# EAGLE design SensorBoardR1 (EAGLE 7.6.0)
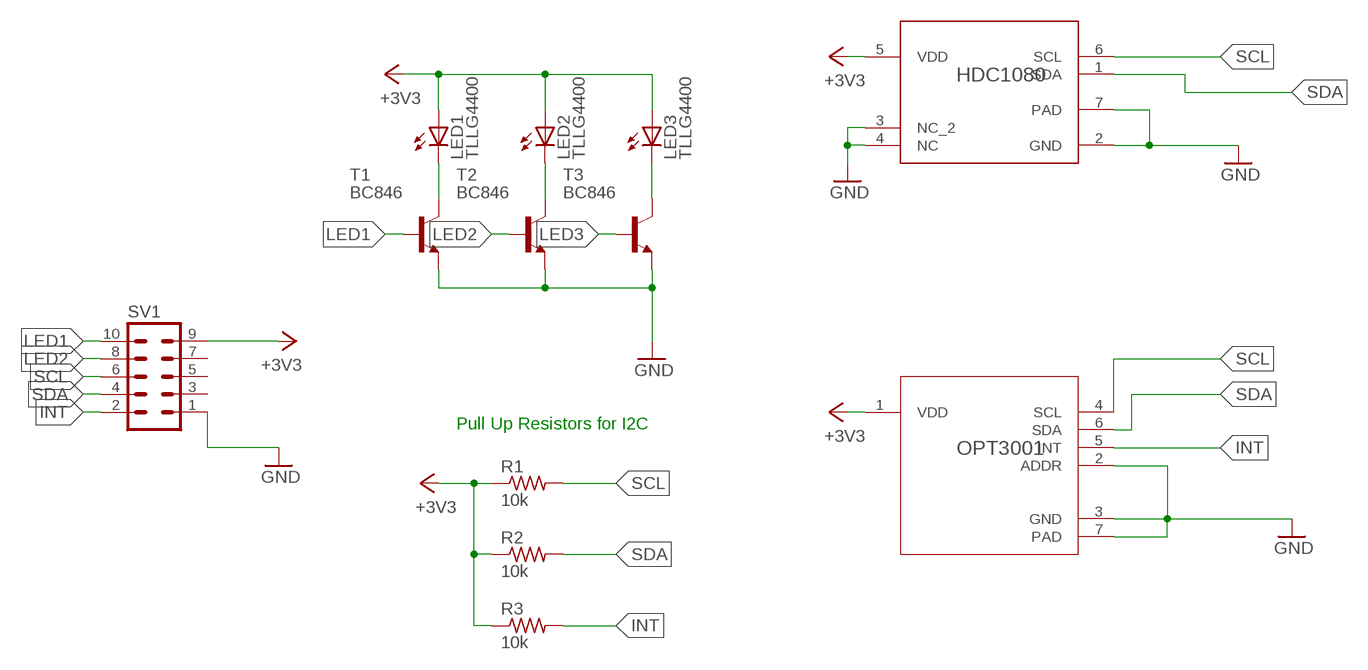
[diagram p0: schematic, sheet 1]

## Parts
HDC1080  HDC1080DMBR  [DMB0006A]
LED1  TLLG4400  [LED3MM]
LED2  TLLG4400  [LED3MM]
LED3  TLLG4400  [LED3MM]
OPT3001  OPT3001DNPR  [DNP0006A]
R1  10k  R-US_R0805  [R0805]
R2  10k  R-US_R0805  [R0805]
R3  10k  R-US_R0805  [R0805]
SV1  MA05-2  [MA05-2]
T1  BC846  [SOT23]
T2  BC846  [SOT23]
T3  BC846  [SOT23]

## Nets
+3V3: HDC1080.5(VDD) LED1.A LED2.A LED3.A OPT3001.1(VDD) R1.1 R2.1 R3.1 SV1.9
GND: HDC1080.2(GND) HDC1080.3(NC_2) HDC1080.4(NC) HDC1080.7(PAD) OPT3001.2(ADDR) OPT3001.3(GND) OPT3001.7(PAD) SV1.1 T1.2(E) T2.2(E) T3.2(E)
INT: OPT3001.5(INT) R3.2 SV1.2
LED1: SV1.10 T1.1(B)
LED2: SV1.8 T2.1(B)
LED3: T3.1(B)
N$2: LED3.K(C) T3.3(C)
N$3: LED2.K(C) T2.3(C)
N$4: LED1.K(C) T1.3(C)
SCL: HDC1080.6(SCL) OPT3001.4(SCL) R1.2 SV1.6
SDA: HDC1080.1(SDA) OPT3001.6(SDA) R2.2 SV1.4
Unconnected: SV1.3 SV1.5 SV1.7

## Notes on the sheet
- Pull Up Resistors for I2C

## Library data of the parts
HDC1080 = HDC1080:HDC1080DMBR; ALTERNATEPARTNUMBER: HDC1080DMBT; APPLICATION_BUILDNUMBER: *; COMPTYPE: IC; MANUFACTURER: Texas Instruments; MOUNTTYPE: SMT; PACKAGEREFERENCE: DMB0006A; PARTNUMBER: HDC1080DMBR; PIN_COUNT: 7; REFDES: RefDes; TYPE: TYPE; VALUE: Value
LED1-LED3 = led:TLLG4400: Low Current (2mA) LED 3 mm Tinted Diffused Package color GREEN Source: Data sheet <http://www.farnell.com/datasheets/391098.pdf>; MF: VISHAY SEMICONDUCTOR; OC_FARNELL: 1612435
OPT3001 = OPT3001:OPT3001DNPR; APPLICATION_BUILDNUMBER: *; COMPTYPE: IC; MANUFACTURER: Texas Instruments; MOUNTTYPE: SMT; PACKAGEREFERENCE: DNP0006A; PARTNUMBER: OPT3001DNP; PIN_COUNT: 7; REFDES: RefDes; ROHS: Y; TYPE: TYPE; VALUE: Value
R1-R3 = rcl:R-US_: RESISTOR, American symbol
SV1 = con-lstb:MA05-2: PIN HEADER; OC_FARNELL: unknown; OC_NEWARK: unknown
T1-T3 = transistor:BC846: NPN TRANSISTOR

## Board
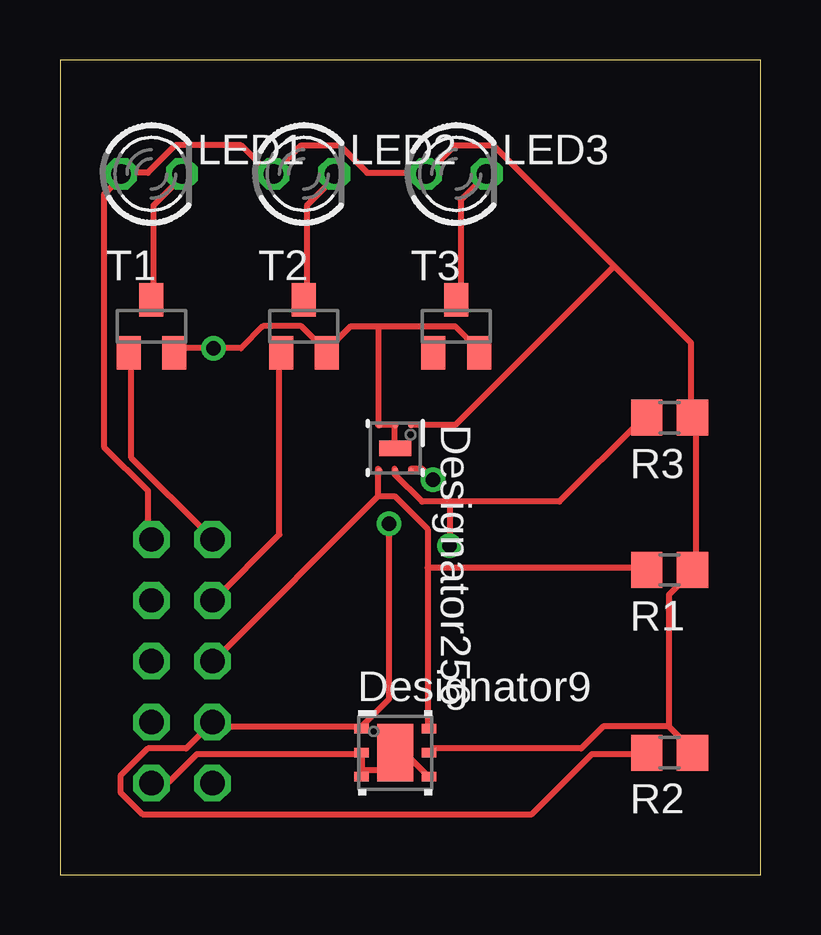
[diagram p1: board, top side]
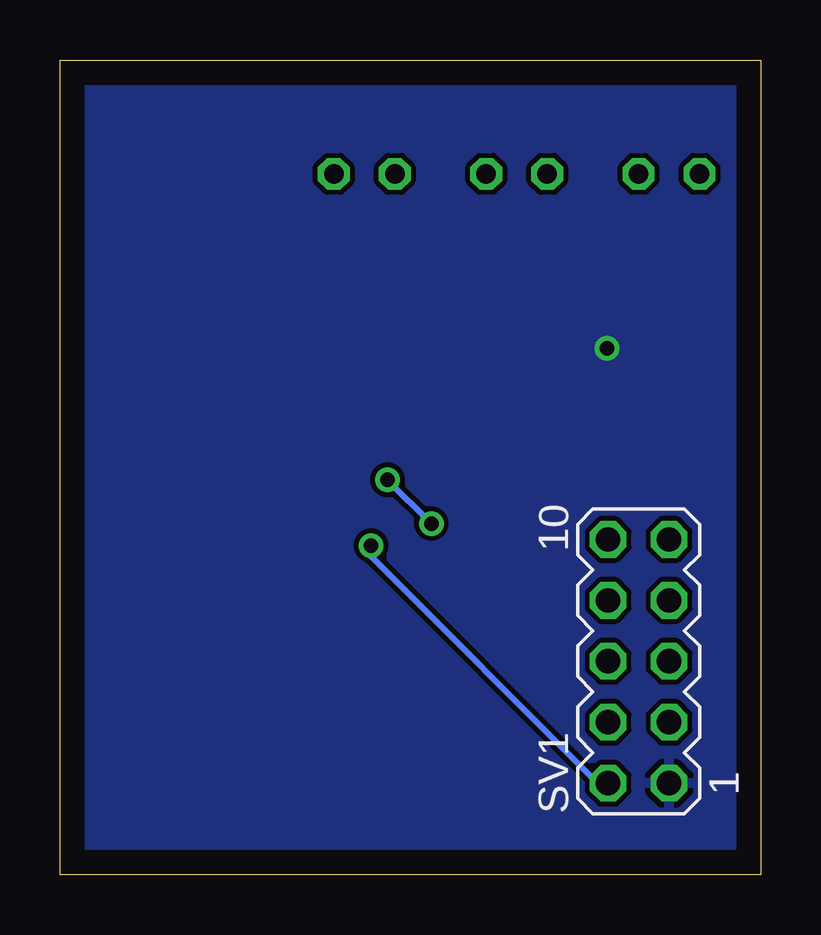
[diagram p2: board, bottom side, seen from below]

Size 29.19 x 33.96 mm. Coordinates in mm from the lower left corner, seen from the top.
Outline: 0,0 29.19,0 29.19,33.96 0,33.96 0,0
Copper layers (1*16): Top 0.035mm / dielectric 1.5mm / Bottom 0.035mm
Design rules "default": minimum track width 10mil, minimum drill 24mil, track to track 8mil, track to pad 8mil, pad to pad 8mil, via to via 8mil, smd to smd 8mil, copper to edge 40mil, drill to drill 8mil, minimum pad ring 10mil, minimum via ring 8mil, stop-mask expansion 4mil, vias tented up to drill 0mil, thermal gap 10mil

### Footprints (pad centres in the part's own frame; a part is rotated, then mirrored left to right if it is on the bottom)
DMB0006A = smd 0.6 x 0.4: 1 -1.4,1; 2 -1.4,0; 3 -1.4,-1; 4 1.4,-1; 5 1.4,0; 6 1.4,1 | smd 1.5 x 2.4: 7 0,0 | smd 0.5 x 0.5: V -0.5,0
LED3MM = drill 0.813 octagon: A -1.27,0; K 1.27,0
DNP0006A = smd 0.25 x 0.25: 1 -0.95,0.65; 2 -0.95,0; 3 -0.95,-0.655; 4 0.95,-0.65; 5 0.95,0; 6 0.95,0.65 | smd 0.65 x 1.35: 7 0,0
R0805 = smd 1.3 x 1.5: 1 -0.95,0; 2 0.95,0
MA05-2 = drill 1.016 octagon: 1 -5.08,-1.27; 2 -5.08,1.27; 3 -2.54,-1.27; 4 -2.54,1.27; 5 0,-1.27; 6 0,1.27; 7 2.54,-1.27; 8 2.54,1.27; 9 5.08,-1.27; 10 5.08,1.27
SOT23 = smd 1 x 1.4: 1 -0.95,-1.1; 2 0.95,-1.1; 3 0,1.1

### Placement (x,y rotation side)
HDC1080  13.97,5.08 0 top
LED1  3.81,29.21 0 top
LED2  10.16,29.21 0 top
LED3  16.51,29.21 0 top
OPT3001  13.97,17.78 270 top
R1  25.4,12.7 180 top
R2  25.4,5.08 180 top
R3  25.4,19.05 180 top
SV1  5.08,8.89 90 bottom
T1  3.81,22.86 0 top
T2  10.16,22.86 0 top
T3  16.51,22.86 0 top

### Tracks (layer width: path | path; a pad name or v marks a point on that pad's centre or on a via)
+3V3
  Top 0.254: 25.38,6.17 22.63,6.17 21.72,5.26 15.54,5.26 HDC1080.5 | 25.38,6.17 26.29,5.26 R2.1 | 25.38,6.17 25.38,11.66 26.29,12.57 R1.1 26.52,12.8 26.52,18.97 R3.1 26.29,19.2 26.29,22.17 23.09,25.38 | SV1.9 3.66,14.17 3.66,16 1.83,17.83 1.83,28.35 2.52,29.03 LED1.A 2.74,29.26 3.66,29.26 4.8,30.4 7.54,30.4 8.69,29.26 LED2.A 8.91,29.26 10.06,30.4 11.66,30.4 12.8,29.26 15.09,29.26 LED3.A 15.32,29.26 16.46,30.4 18.06,30.4 23.09,25.38 | 23.09,25.38 16.46,18.75 14.63,18.75 OPT3001.1
GND  (via drill 0.61)
  Top 0.254: T1.2 4.8,21.95 v6.4,21.95 7.54,21.95 8.46,22.86 10.06,22.86 10.97,21.95 T2.2 11.2,21.95 12.12,22.86 13.26,22.86 | 13.26,22.86 16.46,22.86 17.37,21.95 T3.2 | 13.95,18.75 13.26,18.75 | 13.95,18.75 13.95,17.83 OPT3001.7 | 13.95,18.75 OPT3001.2 | 13.26,22.86 13.26,18.75 | 13.26,18.75 OPT3001.3 | 12.57,4.34 12.57,5.03 HDC1080.2 12.34,5.03 5.71,5.03 4.57,3.89 3.89,3.89 SV1.1 | 12.57,4.34 12.57,4.12 HDC1080.3 | 14.4,5.03 14.17,5.26 HDC1080.7 14.4,5.03 | 14.4,5.03 15.32,4.12 HDC1080.4 | 12.57,4.34 13.72,4.34 14.4,5.03
  pour Bottom: 0,34.29 0,0 29.21,0 29.21,34.29
  pour Bottom: 1.27,33.02 1.27,1.27 27.94,1.27 27.94,33.02
INT  (via drill 0.61)
  Top 0.254: 16.23,15.54 20.8,15.54 24.23,18.97 R3.2 | 16.23,15.54 15.09,15.54 13.95,16.69 13.95,16.92 OPT3001.5 | 16.23,15.54 v16.23,13.72
  Bottom 0.254: v16.23,13.72 16.23,13.26 6.86,3.89 6.4,3.89 SV1.2
LED1
  Top 0.254: T1.1 2.97,21.72 2.97,17.37 6.17,14.17 SV1.10
LED2
  Top 0.254: T2.1 9.14,21.72 9.14,14.17 6.4,11.43 SV1.8
N$2
  Top 0.254: LED3.K 16.69,28.12 16.69,24 T3.3
N$3
  Top 0.254: T2.3 10.29,24 10.29,27.89 11.43,29.03 LED2.K
N$4
  Top 0.254: T1.3 3.89,24 3.89,27.89 5.03,29.03 LED1.K
SCL
  Top 0.254: 13.26,15.77 13.26,16.92 OPT3001.4 | 13.26,15.77 6.4,8.91 SV1.6 | 15.32,12.8 15.32,14.4 13.95,15.77 13.26,15.77 | 15.32,12.8 15.32,6.17 HDC1080.6 | 15.32,12.8 24.23,12.8 R1.2
SDA  (via drill 0.61)
  Top 0.254: v15.54,16.46 15.09,16.92 14.63,16.92 OPT3001.6 | v13.72,14.63 13.72,7.32 12.57,6.17 HDC1080.1 12.34,6.17 6.4,6.17 SV1.4 5.26,5.26 3.66,5.26 2.52,4.12 2.52,3.43 3.43,2.52 19.66,2.52 22.17,5.03 24.23,5.03 R2.2
  Bottom 0.254: v13.72,14.63 v15.54,16.46